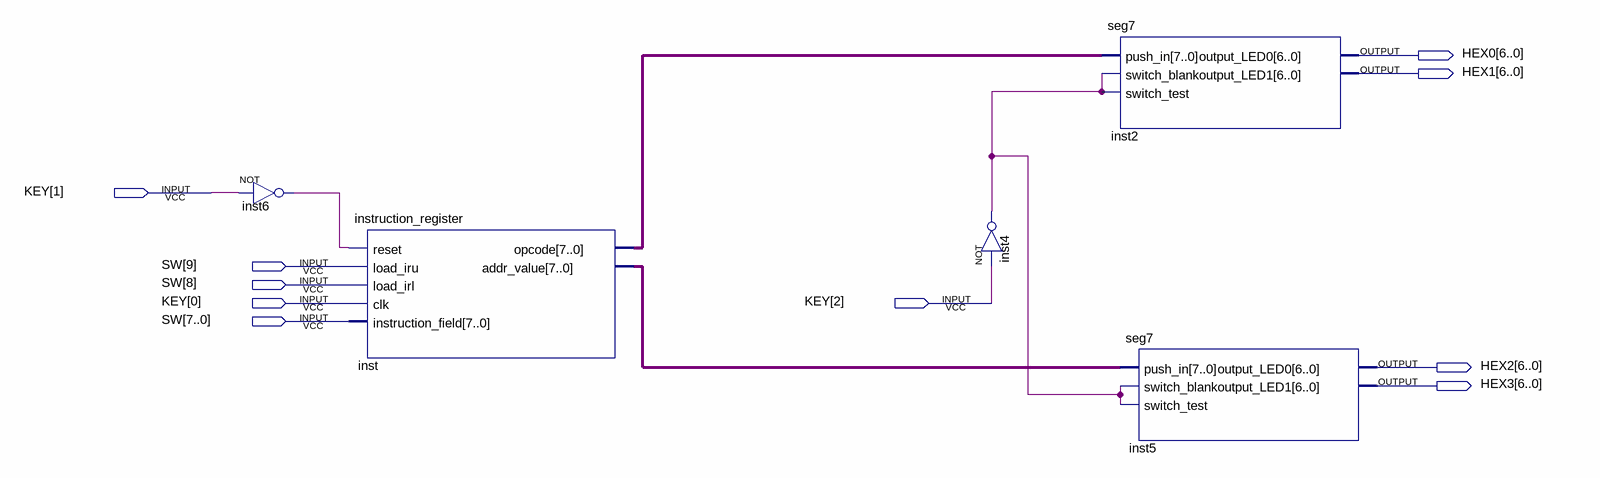
[diagram p0: schematic sheet]
// Quartus schematic ir_tb.bdf as structural Verilog: 5 symbols, 10 pins
module ir_tb (
  input  [2:0] KEY,
  input  [9:0] SW,
  output [6:0] HEX0,
  output [6:0] HEX1,
  output [6:0] HEX2,
  output [6:0] HEX3
);

  wire inst4_out, inst6_out;
  wire [7:0] inst_addr_value, inst_opcode;

  not inst6 (inst6_out, KEY[1]);
  instruction_register inst (
    .reset(inst6_out), .load_iru(SW[9]), .load_irl(SW[8]), .clk(KEY[0]), .instruction_field(SW[7:0]),
    .opcode(inst_opcode), .addr_value(inst_addr_value));
  not inst4 (inst4_out, KEY[2]);
  seg7 inst2 (
    .push_in(inst_opcode), .switch_blank(inst4_out), .switch_test(inst4_out), .output_LED0(HEX0),
    .output_LED1(HEX1));
  seg7 inst5 (
    .push_in(inst_addr_value), .switch_blank(inst4_out), .switch_test(inst4_out), .output_LED0(HEX2),
    .output_LED1(HEX3));
endmodule
